# EAGLE design CANBed2040 (EAGLE 6.4)
DESCRIPTION: microOBD 200 OBD-II Module; HW_REV: 1.4; PCB_REV: C; PCB_SPEC1: Layer Count: 4; PCB_SPEC2: Size: 1.3" x 0.59"; PCB_SPEC3: Finish Thickness: 0.049" - 0.052"; PCB_SPEC4: Copper Weight: 1oz; TITLE: STM1120

## Sheet 1 of 2
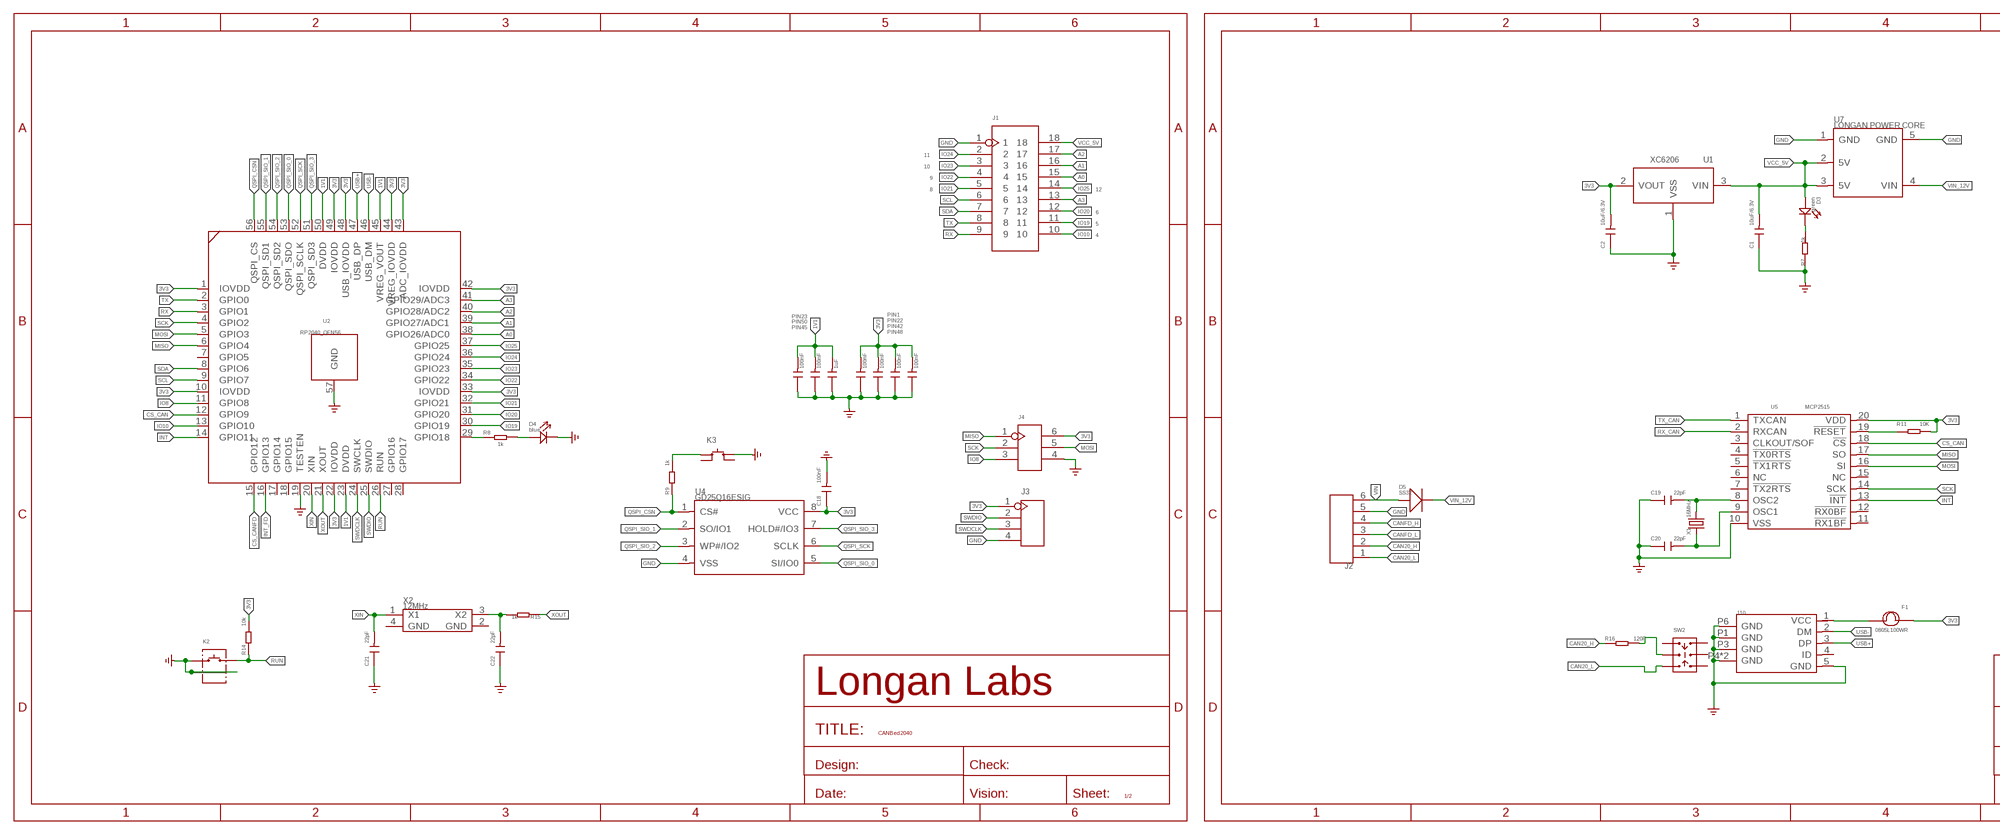
[diagram p0: schematic, sheet 1, part 1 of 2]
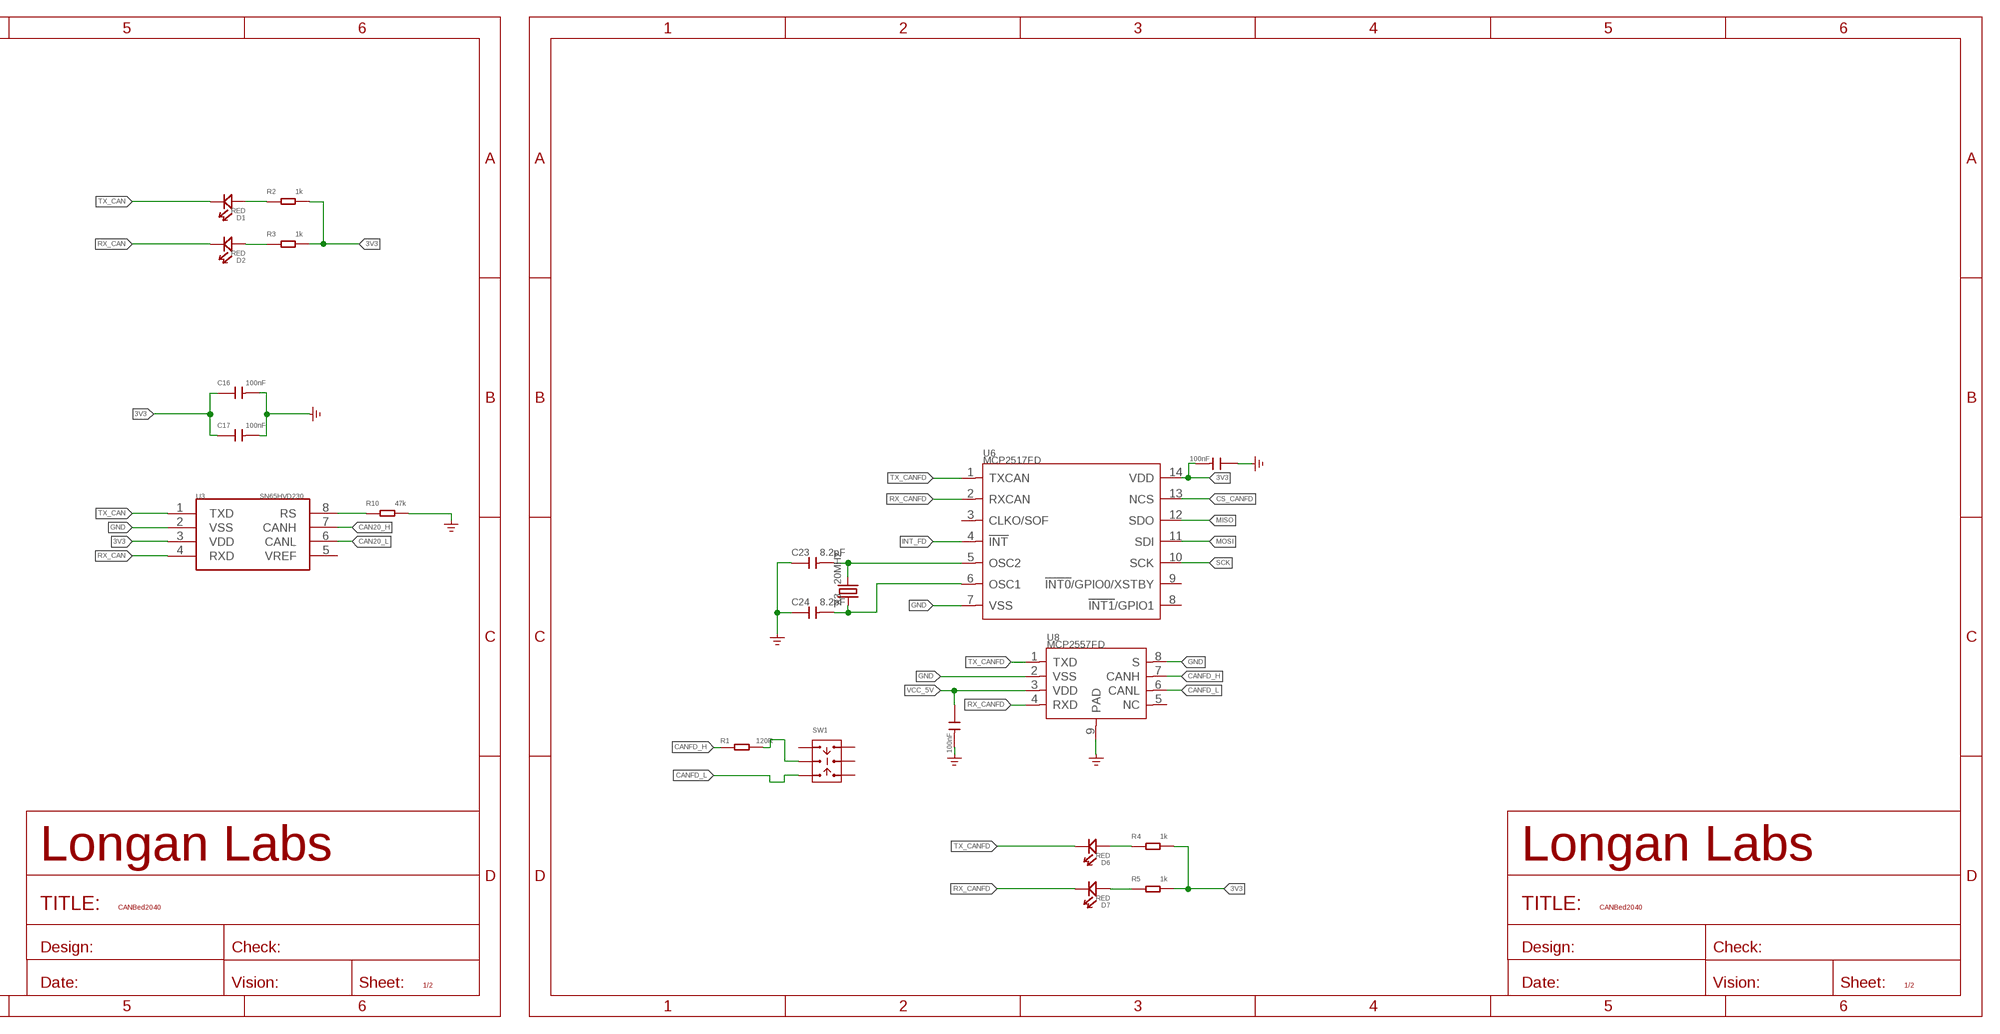
[diagram p1: schematic, sheet 1, part 2 of 2]

### Parts
C1  10uF/6.3V  CAP-0603  [C0603]
C2  10uF/6.3V  CAP-0603  [C0603]
C9  100nF  CAP-0603  [C0603]
C10  100nF  CAP-0603  [C0603]
C11  1uF  CAP-0603  [C0603]
C12  100nF  CAP-0603  [C0603]
C13  100nF  CAP-0603  [C0603]
C14  100nF  CAP-0603  [C0603]
C15  100nF  CAP-0603  [C0603]
C16  100nF  CAP-0603  [C0603]
C17  100nF  CAP-0603  [C0603]
C18  100nF  CAP-0603  [C0603]
C19  22pF  CAP-0603  [C0603]
C20  22pF  CAP-0603  [C0603]
C21  22pF  CAP-0603  [C0603]
C22  22pF  CAP-0603  [C0603]
C23  8.2pF  CAP-0603  [C0603]
C24  8.2pF  CAP-0603  [C0603]
C25  100nF  CAP-0603  [C0603]
C26  100nF  CAP-0603  [C0603]
D1  RED  LED'0603'  [LED-0603]
D2  RED  LED'0603'  [LED-0603]
D3  green  LED'0603'  [LED-0603]
D4  blue  LED'0603'  [LED-0603]
D5  SS32  DIODE'SMA'  [DO-214AC]
D6  RED  LED'0603'  [LED-0603]
D7  RED  LED'0603'  [LED-0603]
F1  0805L100WR  FUSE0805  [F0805]
J1  HEADER-2X9P-2.54  [H2X9-2.54]
J2  SCREW-TERMINAL-6P-3.5  [H6-3.5-21.7X7.0MM]
J3  HEADER-4P-SMD  [H4-SMD-2.54]
J4  HEADER-2X3P-2.54  [H2X3-2.54]
J10  MICRO-USB5+4P-320010050  [MICRO-USB5+5P-SMD-0.65-7.2X5.06MM]
K2  BUTTON-2+2P  [SW2+2P-7.7X2.75X3.95MM]
K3  BUTTON-4P-4.5X4.5X3.3MM  [SW4-4.5X4.5X3.3MM]
R1  120R  RES-0603  [R0603]
R2  1k  RES-0603  [R0603]
R3  1k  RES-0603  [R0603]
R4  1k  RES-0603  [R0603]
R5  1k  RES-0603  [R0603]
R7  1k  RES-0603  [R0603]
R8  1k  RES-0603  [R0603]
R9  1k  RES-0603  [R0603]
R10  47k  RES-0603  [R0603]
R11  10K  RES-0603  [R0603]
R14  10k  RES-0603  [R0603]
R15  1k  RES-0603  [R0603]
R16  120R  RES-0603  [R0603]
SW1  SWITCH-2CH-6P-311010004  [SW6-2.54-9.0X3.5X3.2+2.0MM]
SW2  SWITCH-2CH-6P-311010004  [SW6-2.54-9.0X3.5X3.2+2.0MM]
U1  XC6206  PMIC-XC6206PMR  [SOT-23]
U2  RP2040_QFN56  [RP2040_QFN56]
U3  SN65HVD230  MCP2551-SOIC8  [SOIC8-6.0]
U4  GD25Q16ESIG  FLASH-GD25Q16E  [SOP8-1.27-5.3X5.25X2MM]
U5  MCP2515  MCP2515'ST'  [TSSOP20-0.65-6.5X4.4MM]
U6  MCP2517FD  CONTROLLER-MCP2517FD  [SOIC14-1.27-8.6X3.9MM]
U7  LONGAN POWER CORE  MOUDLE-POWER_CORE  [MOUDLE5P-2.54-19X12MM]
U8  MCP2557FD  TRANSCEIVER-MCP2557FD  [TDFN8-0.5-2X3X0.75MM]
X1  16MHz  CRYSTAL-2P-3225  [X4-SMD-3.2X2.5X0.7MM]
X2  12MHz  CRYSTAL-4P-3225  [X4-SMD-3.2X2.5X0.7MM]
X3  20MHz  CRYSTAL-2P-3225  [X4-SMD-3.2X2.5X0.7MM]

### Nets
1V1: C9.2 C10.2 C11.2 U2.23(DVDD) U2.45(VREG_VOUT) U2.50(DVDD)
3V3: C2.2 C12.2 C13.2 C14.2 C15.2 C16.1 C17.1 C18.1 C25.2 F1.1 J3.1 J4.6 R2.2 R3.2 R4.2 R5.2 R11.2 R14.2 U1.2(VOUT) U2.1(IOVDD) U2.10(IOVDD) U2.22(IOVDD) U2.33(IOVDD) U2.42(IOVDD) U2.43(ADC_IOVDD) U2.44(VREG_IOVDD) U2.48(USB_IOVDD) U2.49(IOVDD) U3.3(VDD) U4.8(VCC) U5.20(VDD) U6.14(VDD)
A0: J1.15 U2.38(GPIO26/ADC0)
A1: J1.16 U2.39(GPIO27/ADC1)
A2: J1.17 U2.40(GPIO28/ADC2)
A3: J1.13 U2.41(GPIO29/ADC3)
CAN20_H: J2.2 R16.1 U3.7(CANH)
CAN20_L: J2.1 SW2.CH1B U3.6(CANL)
CANFD_H: J2.4 R1.1 U8.7(CANH)
CANFD_L: J2.3 SW1.CH1B U8.6(CANL)
CS_CAN: U2.12(GPIO9) U5.18(!CS)
CS_CANFD: U2.15(GPIO12) U6.13(NCS)
EXT_PWR: F1.2 J10.1(VCC)
GND: C1.1 C2.1 C9.1 C10.1 C11.1 C12.1 C13.1 C14.1 C15.1 C16.2 C17.2 C18.2 C19.1 C20.1 C21.1 C22.1 C23.1 C24.1 C25.1 C26.2 D4.- J1.1 J2.5 J3.4 J4.4 J10.5(GND) J10.P1(GND) J10.P3(GND) J10.P4(GND) J10.P5(GND) J10.P6(GND) K2.1 K2.S1 K2.S2 K3.3(B0) R7.1 R10.2 U1.1(VSS) U2.19(TESTEN) U2.57(GND) U3.2(VSS) U4.4(VSS) U5.10(VSS) U6.7(VSS) U7.1(GND) U7.5(GND) U8.2(VSS) U8.8(S) U8.9(PAD) ; supply symbol labelled GND_POWER
INT: U2.14(GPIO11) U5.13(!INT)
INT_FD: U2.16(GPIO13) U6.4(!INT)
IO8: J4.3 U2.11(GPIO8)
IO10: J1.10 U2.13(GPIO10)
IO19: J1.11 U2.30(GPIO19)
IO20: J1.12 U2.31(GPIO20)
IO21: J1.5 U2.32(GPIO21)
IO22: J1.4 U2.34(GPIO22)
IO23: J1.3 U2.35(GPIO23)
IO24: J1.2 U2.36(GPIO24)
IO25: J1.14 U2.37(GPIO25)
MISO: J4.1 U2.6(GPIO4) U5.17(SO) U6.12(SDO)
MOSI: J4.5 U2.5(GPIO3) U5.16(SI) U6.11(SDI)
N$1: D3.- R7.2
N$2: D1.+ R2.1
N$3: R8.1 U2.29(GPIO18)
N$4: R1.2 SW1.COM1
N$5: R16.2 SW2.COM1
N$6: D4.+ R8.2
N$7: K3.1(A0) R9.2
N$8: C22.2 R15.2 X2.3(X2)
N$9: D6.+ R4.1
N$10: D7.+ R5.1
N$11: C23.2 U6.5(OSC2) X3.3
N$12: C24.2 U6.6(OSC1) X3.1
N$15: D2.+ R3.1
N$16: C19.2 U5.8(OSC2) X1.3
N$17: C20.2 U5.9(OSC1) X1.1
N$20: R10.1 U3.8(RS)
QSPI_CSN: R9.1 U2.56(QSPI_CS) U4.1(CS#)
QSPI_SCK: U2.52(QSPI_SCLK) U4.6(SCLK)
QSPI_SIO_0: U2.53(QSPI_SDO) U4.5(SI/IO0)
QSPI_SIO_1: U2.55(QSPI_SD1) U4.2(SO/IO1)
QSPI_SIO_2: U2.54(QSPI_SD2) U4.3(WP#/IO2)
QSPI_SIO_3: U2.51(QSPI_SD3) U4.7(HOLD#/IO3)
RST_N: R11.1 U5.19(!RESET)
RUN: K2.2 R14.1 U2.26(RUN)
RX: J1.9 U2.3(GPIO1)
RX_CAN: D2.- U3.4(RXD) U5.2(RXCAN)
RX_CANFD: D7.- U6.2(RXCAN) U8.4(RXD)
SCK: J4.2 U2.4(GPIO2) U5.14(SCK) U6.10(SCK)
SCL: J1.6 U2.9(GPIO7)
SDA: J1.7 U2.8(GPIO6)
SWDCLK: J3.3 U2.24(SWCLK)
SWDIO: J3.2 U2.25(SWDIO)
TX: J1.8 U2.2(GPIO0)
TX_CAN: D1.- U3.1(TXD) U5.1(TXCAN)
TX_CANFD: D6.- U6.1(TXCAN) U8.1(TXD)
USB+: J10.3(DP) U2.47(USB_DP)
USB-: J10.2(DM) U2.46(USB_DM)
VCC_5V: C1.2 C26.1 D3.+ J1.18 U1.3(VIN) U7.2(5V) U7.3(5V) U8.3(VDD)
VIN: D5.1(+) J2.6
VIN_12V: D5.2(-) U7.4(VIN)
XIN: C21.2 U2.20(XIN) X2.1(X1)
XOUT: R15.1 U2.21(XOUT)
Unconnected: J10.4(ID) K3.2(A1) K3.4(B1) SW1.CH1A SW1.CH2A SW1.CH2B SW1.COM2 SW2.CH1A SW2.CH2A SW2.CH2B SW2.COM2 U2.7(GPIO5) U2.17(GPIO14) U2.18(GPIO15) U2.27(GPIO16) U2.28(GPIO17) U3.5(VREF) U5.3(CLKOUT/SOF) U5.4(!TX0RTS) U5.5(!TX1RTS) U5.6(NC) U5.7(!TX2RTS) U5.11(!RX1BF) U5.12(!RX0BF) U5.15(NC) U6.3(CLKO/SOF) U6.8(!INT1!/GPIO1) U6.9(!INT0!/GPIO0/XSTBY) U8.5(NC) X2.2(GND) X2.4(GND)

### Notes on the sheet
- 11
- 10
- 9
- 8 | 12
- 6
- 5
- 4
- PIN23
- PIN1
- PIN50
- PIN22
- PIN45
- PIN42
- PIN48

## Sheet 2 of 2

## Library data of the parts
C1 C2 C9-C26 = Discrete-new:CAP: Ceramic Capacitors
D1-D4 D6 D7 = Discrete-new:LED
D5 = Discrete-new:DIODE*
F1 = Discrete-small:FUSE
J1 = Connector-new:HEADER-2X9P
J2 = Connector-new:SCREW-TERMINAL-6P: 320110059
J3 = Connector-new:HEADER-4P
J4 = Connector-new:HEADER-2X3P
J10 = Connector-new:MICRO-USB5+4P: 320010137:MICRO USB B型DIP 沉板0.7无卷边 -ST-USB-01H2 320010000:MICRO USB 5F CCHT 6.45(0.8X0.9) -ST-USB-001G 320010050:USB-MC-001-05 320010025:MICRO USB 5S AB TYPE DIP7.2
K2 = Connector-new:BUTTON-2+2P
K3 = Switch:BUTTON-4P
R1-R5 R7-R11 R14-R16 = Discrete-new:RES
SW1 SW2 = Switch:SWITCH-2CH-6P
U1 = IC-new:PMIC-XC6206P: LOW ESR Cap.Compatible Positive Voltage Regulators
U2 = RP2040_QFN56:RP2040_QFN56
U3 = IC:MCP2551: High-Speed CAN Transceiver http://ww1.microchip.com/downloads/en/devicedoc/21667f.pdf
U4 = Longan-IC:FLASH-GD25Q16E
U5 = Heilight:MCP2515
U6 = untitled:CONTROLLER-MCP2517FD
U7 = Longan-moudle:MOUDLE-POWER_CORE
U8 = Longan-IC:TRANSCEIVER-MCP2557FD
X1 X3 = Discrete-new:CRYSTAL-2P
X2 = Discrete-new:CRYSTAL-4P

## Net classes
3 usbvcc: width 0.152 mm, drill 0.152 mm, clearance 0.152 mm

## Board
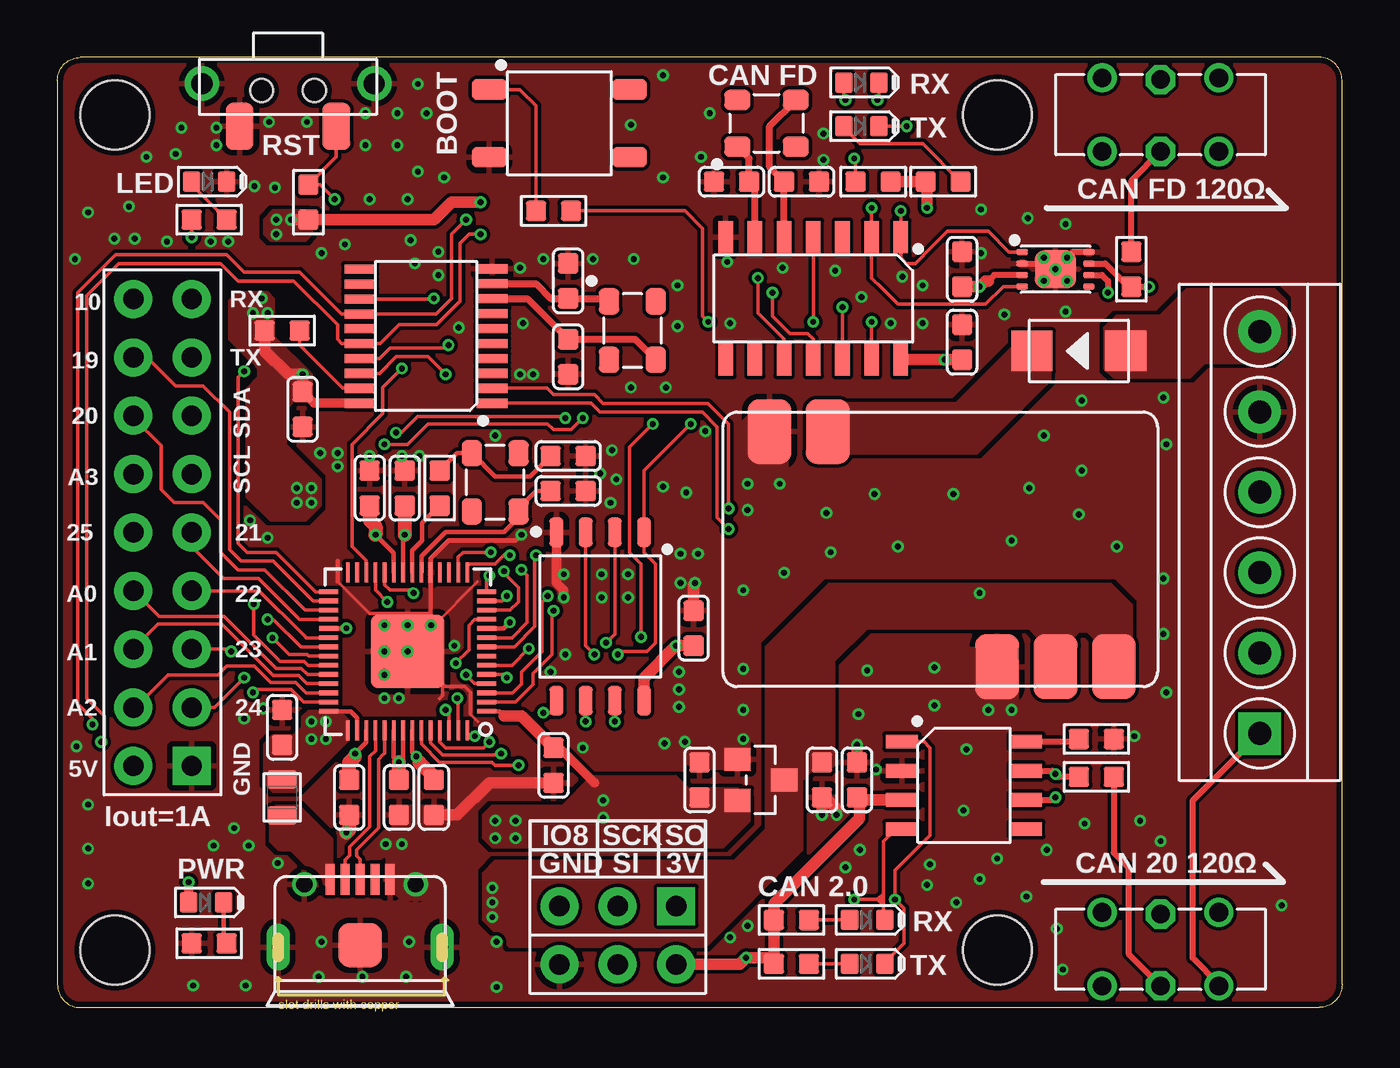
[diagram p2: board, top side]
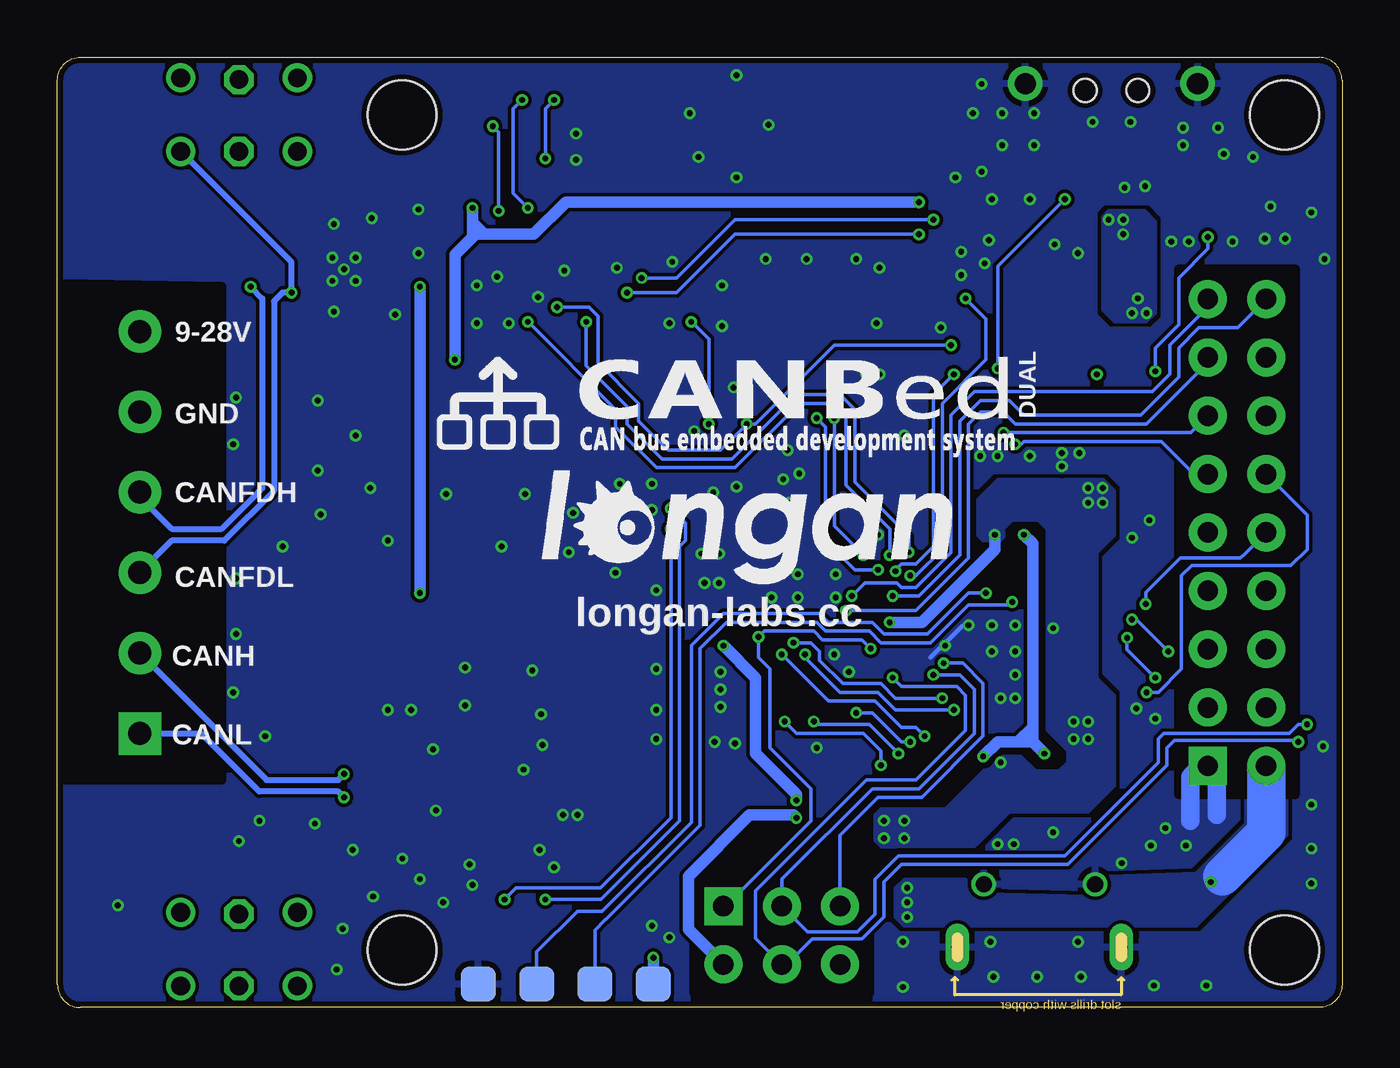
[diagram p3: board, bottom side, seen from below]

Size 55.91 x 41.35 mm. Coordinates in mm from the lower left corner, seen from the top.
Outline: 1,0 54.91,0 arc90 55.91,1 55.91,40.35 arc84 55.01,41.35 1,41.35 arc90 0,40.35 0,1 arc90 1,0
Copper layers (1*16): Top 0.035mm / dielectric 1.5mm / Bottom 0.035mm
Design rules "SeeedStudio_2layer_DRU_no_angle_20140221 *": minimum track width 1mil, minimum drill 10mil, track to track 6mil, track to pad 6mil, pad to pad 6mil, via to via 6mil, smd to smd 0mil, copper to edge 10mil, drill to drill 10mil, minimum pad ring 4mil, minimum via ring 4mil, stop-mask expansion 2mil, vias tented up to drill 25mil, thermal gap 10mil
Holes 3 mm at 2.5,38.85 2.5,2.5 40.91,38.85 40.91,2.5
bRestrict: area 2,9.3 to 7.1,32.1; area 48.8,9.9 to 55.9,31.5; area 20.6,0.6 to 28.2,5.7

### Footprints (pad centres in the part's own frame; a part is rotated, then mirrored left to right if it is on the bottom)
C0603 = smd 0.889 x 0.889: 1 -0.762,0; 2 0.762,0
LED-0603 = smd 0.762 x 0.889: + 0.762,0; - -0.762,0
DO-214AC = smd 1.8 x 1.77: 1 -2.042,0; 2 2.042,0
F0805 = smd 0.819 x 1.27: 1 -0.79,0; 2 0.79,0
H2X9-2.54 = drill 0.889 pad 1.651 square: 1 -1.27,10.16 | drill 0.889 pad 1.651: 2 -1.27,7.62; 3 -1.27,5.08; 4 -1.27,2.54; 5 -1.27,0; 6 -1.27,-2.54; 7 -1.27,-5.08; 8 -1.27,-7.62; 9 -1.27,-10.16; 10 1.27,-10.16; 11 1.27,-7.62; 12 1.27,-5.08; 13 1.27,-2.54; 14 1.27,0; 15 1.27,2.54; 16 1.27,5.08; 17 1.27,7.62; 18 1.27,10.16
H6-3.5-21.7X7.0MM = drill 1 pad 1.85 square: 1 -8.75,0 | drill 1 pad 1.85: 2 -5.25,0; 3 -1.75,0; 4 1.75,0; 5 5.25,0; 6 8.75,0
H4-SMD-2.54 = smd 1.524 x 1.524: 1 0,5.08; 2 0,2.54; 3 0,0; 4 0,-2.54
H2X3-2.54 = drill 0.889 pad 1.651 square: 1 -1.27,2.54 | drill 0.889 pad 1.651: 2 -1.27,0; 3 -1.27,-2.54; 4 1.27,-2.54; 5 1.27,0; 6 1.27,2.54
MICRO-USB5+5P-SMD-0.65-7.2X5.06MM = smd 0.4 x 1.35: 1 -1.3,2.875; 2 -0.65,2.875; 3 0,2.875; 4 0.65,2.875; 5 1.3,2.875 | smd 1.9 x 1.9: P1 0,0 | drill 0.508 pad 1.016 long: P3 -3.575,-0.08; P4 3.575,-0.08 | drill 0.7: P5 -2.425,2.65; P6 2.425,2.65
SW2+2P-7.7X2.75X3.95MM = smd 1.2 x 2.032: 1 -2.1,-0.254; 2 2.1,-0.254 | drill 0.924 pad 1.5: S1 -3.75,1.6; S2 3.75,1.6 | hole 1: -1.15,1.3; 1.15,1.3
SW4-4.5X4.5X3.3MM = smd 1.5 x 0.9: 1 -3.05,1.475; 2 3.05,1.475; 3 -3.05,-1.475; 4 3.05,-1.475
R0603 = smd 0.889 x 0.889: 1 -0.762,0; 2 0.762,0
SW6-2.54-9.0X3.5X3.2+2.0MM = drill 0.813 pad 1.27: CH1A -2.54,-1.6; CH1B 2.54,-1.6; CH2A -2.54,1.6; CH2B 2.54,1.6 | drill 0.813 pad 1.27 octagon: COM1 0,-1.6; COM2 0,1.524
SOT-23 = smd 1.016 x 1.143: 1 -0.889,-1.016; 2 0.889,-1.016; 3 0,1.016
RP2040_QFN56 = smd 0.875 x 0.2: 1 -3.438,2.6; 2 -3.438,2.2; 3 -3.438,1.8; 4 -3.438,1.4; 5 -3.438,1; 6 -3.438,0.6; 7 -3.438,0.2; 8 -3.438,-0.2; 9 -3.438,-0.6; 10 -3.438,-1; 11 -3.438,-1.4; 12 -3.438,-1.8; 13 -3.438,-2.2; 14 -3.438,-2.6; 29 3.438,-2.6; 30 3.438,-2.2; 31 3.438,-1.8; 32 3.438,-1.4; 33 3.438,-1; 34 3.438,-0.6; 35 3.438,-0.2; 36 3.438,0.2; 37 3.438,0.6; 38 3.438,1; 39 3.438,1.4; 40 3.438,1.8; 41 3.438,2.2; 42 3.438,2.6 | smd 0.2 x 0.875: 15 -2.6,-3.438; 16 -2.2,-3.438; 17 -1.8,-3.438; 18 -1.4,-3.438; 19 -1,-3.438; 20 -0.6,-3.438; 21 -0.2,-3.438; 22 0.2,-3.438; 23 0.6,-3.438; 24 1,-3.438; 25 1.4,-3.438; 26 1.8,-3.438; 27 2.2,-3.438; 28 2.6,-3.438; 43 2.6,3.438; 44 2.2,3.438; 45 1.8,3.438; 46 1.4,3.438; 47 1,3.438; 48 0.6,3.438; 49 0.2,3.438; 50 -0.2,3.438; 51 -0.6,3.438; 52 -1,3.438; 53 -1.4,3.438; 54 -1.8,3.438; 55 -2.2,3.438; 56 -2.6,3.438 | smd 3.2 x 3.2: 57 0,0
SOIC8-6.0 = smd 0.6 x 1.4: 1 -1.905,-2.7; 2 -0.635,-2.7; 3 0.635,-2.7; 4 1.905,-2.7; 5 1.905,2.7; 6 0.635,2.7; 7 -0.635,2.7; 8 -1.905,2.7
SOP8-1.27-5.3X5.25X2MM = smd 0.6 x 1.27: 1 -1.905,-3.665; 2 -0.635,-3.665; 3 0.635,-3.665; 4 1.905,-3.665; 5 1.905,3.665; 6 0.635,3.665; 7 -0.635,3.665; 8 -1.905,3.665
TSSOP20-0.65-6.5X4.4MM = smd 0.4 x 1.35: 1 -2.925,-2.875; 2 -2.275,-2.875; 3 -1.625,-2.875; 4 -0.975,-2.875; 5 -0.325,-2.875; 6 0.325,-2.875; 7 0.975,-2.875; 8 1.625,-2.875; 9 2.275,-2.875; 10 2.925,-2.875; 11 2.91,2.875; 12 2.26,2.875; 13 1.61,2.875; 14 0.96,2.875; 15 0.325,2.875; 16 -0.325,2.875; 17 -0.975,2.875; 18 -1.625,2.875; 19 -2.275,2.875; 20 -2.925,2.875
SOIC14-1.27-8.6X3.9MM = smd 0.635 x 1.397: 1 -3.81,-2.667; 2 -2.54,-2.667; 3 -1.27,-2.667; 4 0,-2.667; 5 1.27,-2.667; 6 2.54,-2.667; 7 3.81,-2.667; 8 3.81,2.667; 9 2.54,2.667; 10 1.27,2.667; 11 0,2.667; 12 -1.27,2.667; 13 -2.54,2.667; 14 -3.81,2.667
MOUDLE5P-2.54-19X12MM = smd 2.8 x 1.9: 1 -5.234,-2.159; 2 -5.234,-4.699; 3 -5.234,-7.239; 4 5,5.207; 5 5,7.747
TDFN8-0.5-2X3X0.75MM = smd 0.25 x 0.5: 1 -0.75,-1.45; 2 -0.25,-1.45; 3 0.25,-1.45; 4 0.75,-1.45; 5 0.75,1.45; 6 0.25,1.45; 7 -0.25,1.45; 8 -0.75,1.45 | smd 1.65 x 1.8: 9 0,0
X4-SMD-3.2X2.5X0.7MM = smd 1.143 x 0.889: 1 -1.27,-1.016; 2 1.27,-1.016; 3 1.27,1.016; 4 -1.27,1.016

### Placement (x,y rotation side)
C1  33.27,9.91 90 top
C2  27.94,9.91 270 top
C9  13.59,22.61 270 top
C10  16.38,9.14 90 top
C11  12.7,9.14 90 top
C12  21.59,10.54 90 top
C13  15.11,22.61 270 top
C14  9.78,12.19 270 top
C15  14.86,9.14 90 top
C16  10.67,26.04 270 top
C17  34.8,9.91 90 top
C18  27.69,16.51 90 top
C19  22.22,28.32 90 top
C20  22.22,31.62 270 top
C21  22.22,22.48 180 top
C22  22.22,24 180 top
C23  32.38,35.94 180 top
C24  29.34,35.94 0 top
C25  39.37,28.96 270 top
C26  39.37,32.13 90 top
D1  35.24,1.91 180 top
D2  35.24,3.81 180 top
D3  6.48,4.57 180 top
D4  6.6,35.94 180 top
D5  44.45,28.57 180 top
D6  34.99,38.35 180 top
D7  34.99,40.26 180 top
F1  9.78,9.14 270 top
J1  4.57,20.68 180 top
J2  52.32,20.68 90 top
J3  35.05,1.02 270 bottom
J4  24.38,3.14 270 top
J10  13.17,2.71 0 top
K2  10.03,38.61 0 top
K3  21.84,38.48 0 top
R1  46.74,32.13 90 top
R2  31.94,1.91 180 top
R3  31.94,3.81 180 top
R4  38.54,35.94 180 top
R5  35.5,35.94 0 top
R7  6.6,2.79 0 top
R8  6.6,34.29 0 top
R9  21.59,34.67 180 top
R10  45.21,11.68 0 top
R11  9.78,29.46 180 top
R14  10.92,35.05 270 top
R15  16.64,22.61 90 top
R16  45.21,10.03 0 top
SW1  48.01,38.86 0 top
SW2  48.01,2.54 0 top
U1  30.61,9.91 270 top
U2  15.24,15.49 180 top
U3  39.45,9.67 270 top
U4  23.62,17.02 180 top
U5  16.05,29.22 90 top
U6  32.89,30.86 180 top
U7  38.73,20.07 90 top
U8  43.43,32.13 270 top
U$12  [LONGAN-SILK-SMALL]  36.44,16.97 0 bottom
X1  25.02,29.46 270 top
X2  19.05,22.86 90 top
X3  30.86,38.48 0 top

### Tracks (layer width: path | path; a pad name or v marks a point on that pad's centre or on a via)
1V1  (via drill 0.25 pad 0.51)
  Top 0.203: U2.23 14.64,19.78 v13.84,20.57 | U2.45 13.44,11.53 v12.95,11.05 12.95,10.92 | U2.50 15.44,11.1 v15.62,10.92 15.62,10.8 15.75,10.67
  Top 0.61: C9.2 13.59,21.21 13.84,20.95 v13.84,20.57 | C10.2 16.38,10.03 15.75,10.67 | C11.2 12.7,10.67 12.95,10.92
  Bottom 0.508: v12.95,11.05 13.46,11.56 | 13.46,11.56 14.1,11.56 | 14.1,11.56 14.99,11.56 v15.62,10.92 | 13.46,11.56 13.46,12.19 | 13.46,12.19 13.46,20.19 v13.84,20.57 | 13.46,12.19 14.1,11.56
3V3  (via drill 0.25 pad 0.51)
  Top 0.203: U2.33 12.56,16.49 v12.57,16.51 | U2.22 15.04,20.5 v15.11,20.57 | U2.44 13.04,12.61 12.76,12.89 U2.42 | U2.48 14.64,10.89 v14.86,10.67 15.04,10.85 U2.49 | U2.1 19.24,12.89 19.43,12.7 | U2.10 19.41,16.49 v19.68,16.76
  Top 0.406: C16.1 11.16,26.3 U5.20 | 23.37,9.78 21.84,11.3 C12.2
  Top 0.508: C16.1 v10.67,27.56 10.03,27.56 9.02,28.57 R11.2 | v10.16,34.29 R14.2 16.38,34.29 17.14,35.05 v18.41,35.05 | 19.43,12.7 20.19,12.7 C12.2 | C18.1 v26.92,15.75 25.53,14.35 U4.8 | 34.91,9.03 C17.1 | J4.6 29.68,1.87 v29.97,2.16 30.92,2.16 R2.2 R3.2 31.18,4.51 34.91,8.24 34.91,9.03 | U3.3 34.91,9.03 | v37.85,34.8 37.85,35.88 R4.2 R5.2 | C25.2 v38.61,28.19 U6.14
  Top 0.61: C13.2 v15.11,20.57 | C15.2 v14.86,10.67
  Bottom 0.508: J4.6 28.45,3.4 28.45,5.72 25.78,8.38 23.88,8.38 v23.75,8.26 | v26.92,15.75 25.53,14.35 25.53,11.05 23.75,9.27 v23.75,9.02 | v15.11,20.57 15.11,19.94 18.29,16.76 v19.68,16.76 | J3.1 v29.97,2.16 | v18.41,35.05 33.78,35.05 35.18,33.66 37.21,33.66 37.34,33.66 | 37.34,33.66 37.72,33.66 37.78,33.59 | v38.61,28.19 38.61,32.77 37.78,33.59 | v37.85,34.8 37.85,34.16 | 37.85,34.16 37.85,33.66 37.78,33.59 | 37.34,33.66 37.85,34.16
  other vias: 11.05,12.45 11.05,11.68 11.68,11.68 11.68,12.45 19.05,8.13 19.94,8.13 19.94,7.37 19.05,7.37 11.05,22.61 10.41,22.61 10.41,21.97 11.05,21.97 9.14,30.23 8.51,30.23 8.89,30.86 9.52,34.29 9.52,33.66
  pour Top (isolate 0.254, no thermals): 9.4,9.4 9.39,9.4 9.02,9.79 9.02,11.45 9.38,11.81 10.29,11.81 10.67,12.19 10.67,12.64 10.92,12.89 12.26,12.89 12.64,12.51 12.64,11.62 10.41,9.4 10.14,9.4
  pour Bottom (isolate 0.254, no thermals): 14.35,21.21 13.23,21.21 12.83,20.81 12.83,12.06 11.94,11.18 11.94,10.67 12.32,10.29 13.33,10.29 13.97,10.92 14.99,10.92 17.27,8.64 20.07,8.64 20.32,8.38 20.32,7.27 20.04,6.98 16.03,6.98 15.87,7.11 14.48,8.51 11.05,8.51 9.91,9.65 9.91,13.59 10.67,14.35 10.67,19.81 9.91,20.57 9.91,22.48 10.41,22.99 14.99,22.99 15.87,22.1 15.87,20.57 15.62,20.32 14.86,20.32 14.73,20.45 14.73,20.83
  pour Top (isolate 0.254, no thermals): 26.92,10.03 23.24,10.03 23.24,10.03 21.97,8.76 18.92,8.76 18.54,8.38 18.54,7.39 18.94,6.98 28.96,6.98 30.1,8.13 30.1,9.02 29.59,9.52 27.43,9.52
  pour Top (isolate 0.254, no thermals): 11.43,21.84 11.43,22.99 9.91,24.51 9.91,26.04 10.29,26.42 10.79,26.42 11.05,26.67 11.05,27.56 9.4,29.21 9.4,30.86 9.14,31.11 7.87,31.11 7.49,30.73 7.49,29.08 8.76,27.81 8.76,27.43 8.25,26.92 8.25,22.23 9.27,21.21 10.79,21.21
  pour Bottom (isolate 0.254, no thermals): 10.16,34.67 8.59,34.67 8.13,34.21 8.13,30.23 8.51,29.84 9.91,29.84 10.41,30.35 10.41,34.42
  pour Top (isolate 0.254, no thermals): 10.67,34.67 9.4,34.67 9.02,34.29 9.02,33.66 9.27,33.4 10.79,33.4 11.05,33.66 11.05,34.42 10.79,34.67
A0
  Top 0.152: J1.15 4.42,17.02 7.26,17.02 9.52,14.76 10.62,14.76 10.88,14.49 U2.38
A1
  Top 0.152: J1.16 3.3,15.62 4.38,16.7 7.15,16.7 9.4,14.45 10.49,14.45 10.85,14.09 U2.39
A2
  Top 0.152: J1.17 3.4,13.05 4.83,14.48 6.98,14.48 7.37,14.86 8.56,14.86 9.27,14.15 10.36,14.15 10.82,13.69 U2.40
A3  (via drill 0.25 pad 0.51)
  Top 0.152: U2.41 10.71,13.29 10.16,13.84 8.64,13.84 v8.51,13.72
  Bottom 0.152: J1.13 1.52,21.44 1.52,19.94 2.22,19.24 6.54,19.24 6.98,18.8 6.98,14.73 8,13.72 v8.51,13.72
CAN20_H  (via drill 0.25 pad 0.51)
  Top 0.254: U3.7 43.29,10.3 v43.43,10.16 43.56,10.03 R16.1
  Bottom 0.254: J2.2 46.8,9.91 43.69,9.91 v43.43,10.16
CAN20_L  (via drill 0.25 pad 0.51)
  Top 0.254: U3.6 43.32,9.03 v43.43,9.14 | SW2.CH1B 50.55,1.02 49.4,2.16 49.4,9 J2.1
  Bottom 0.254: v43.43,9.14 43.69,9.4 47.12,9.4 49.64,11.92 J2.1
CANFD_H  (via drill 0.25 pad 0.51)
  Top 0.254: U8.7 45.6,32.38 46.61,31.37 R1.1 v47.5,31.37
  Bottom 0.254: v47.5,31.37 46.99,30.86 46.99,22.61 47.12,22.48 47.18,22.42 48.77,20.83 50.93,20.83 52.32,22.23 J2.4
CANFD_L  (via drill 0.25 pad 0.51)
  Top 0.254: U8.6 45.46,31.88 45.72,31.62 v45.72,31.11
  Bottom 0.254: SW1.CH1B 45.72,32.44 v45.72,31.11 46.1,31.11 46.48,30.73 46.48,22.48 48.64,20.32 50.93,20.32 J2.3
CS_CAN  (via drill 0.25 pad 0.51)
  Top 0.152: U2.12 19.71,17.29 20.07,17.65 20.07,18.29 19.62,18.73 19.56,18.8 19.43,18.92 v19.43,18.99 | U5.18 14.01,27.6 14.73,28.32 16.13,28.32 v16.89,27.56
  Bottom 0.152: v16.89,27.56 17.78,26.67 17.78,20.07 18.54,19.3 19.18,19.3 19.43,19.05 v19.43,18.99
CS_CANFD  (via drill 0.25 pad 0.51)
  Top 0.152: v19.68,19.68 19.43,19.68 19.05,19.3 17.91,19.3 17.84,19.24 U2.15 | U6.13 v35.43,29.84
  Bottom 0.152: v19.68,19.68 19.68,20.83 21.59,22.73 21.59,25.91 21.97,26.29 23.62,26.29 26.42,23.5 29.84,23.5 31.62,25.27 31.62,26.04 v35.43,29.84
EXT_PWR
  pour Top (isolate 0.254, no thermals): 11.81,5.21 10.16,6.86 9.65,6.86 9.27,7.24 9.27,8.51 9.52,8.76 10.52,8.76 11.94,7.34 11.94,5.33
GND  (via drill 0.25 pad 0.51)
  Top 0.127: 13.58,17.15 12.19,18.54 | 18.28,18.54 16.38,16.64 v16.26,16.64 | 17.97,12.76 18.29,12.45
  Top 0.152: 16.24,17.15 13.58,17.15 | 15.24,15.37 15.49,15.37 16.76,14.1 | 16.76,14.1 16.89,13.97 17.72,13.97 17.97,13.72 17.97,12.76 | 16.76,14.1 16.76,13.59 16.64,13.46
  Top 0.203: U2.57 15.24,15.37 16.24,16.37 16.24,17.15 U2.19 16.24,19.54 17.02,20.32 19.94,20.32 v20.19,20.57 | 12.19,18.54 12.19,19.43 | 21.72,20.32 21.78,20.26
  Top 0.254: U8.2 42.67,32.38 v42.93,32.64 | U8.8 44.18,32.88 v43.94,32.64
  Top 0.406: 21.78,20.26 21.72,20.19 U4.4 21.72,18.48 22.03,18.16 v22.03,17.84
  Top 0.508: C18.2 27.69,18.41 v27.75,18.48 | C12.1 18.8,9.78 17.4,8.38 C10.1 | v33.27,8.38 C1.1 33.4,9.14 33.91,8.64 v33.91,8.38 | C17.2 v34.8,11.43
  Top 0.61: C11.1 12.7,7.75 v12.57,7.62
  Bottom 0.152: v16.26,16.64 16.51,16.64
  Bottom 0.203: 16.51,16.64 17.91,15.24
  Bottom 0.813: 6.6,8.13 6.6,10.03 6.12,10.52 J1.1 5.84,10.16 5.71,10.16 5.46,9.91 5.46,8.38
  other vias: 20.13,32.19 20.26,29.78 14.8,38.93 5.4,38.29 5.14,37.15 3.87,37.02 1.33,34.61 1.33,6.92 1.33,5.4 7.68,7.81 11.49,2.86 15.3,2.86 19.11,2.86 19.11,0.89 15.56,32.38 26.48,26.99 25.08,32.58 21.15,32.58 24.96,26.99 5.91,0.95 8.19,0.95 22.86,11.3 26.42,11.49 29.27,3.05 30.04,3.56 16.57,31.88 8.95,13.02 53.28,4.45 43.5,3.43 43.75,1.65 27.11,18.48 27.11,19.75 27.88,19.75 27.37,22.42 30.04,21.65 30.04,22.8 20.13,27.56 20.7,27.56 23.3,32.58 27.05,14.6 27.05,13.84 27.05,13.08 8.13,12.57 12.19,24.13 12.19,23.56 13.59,24 14.99,24 8.57,35.75 12.51,33.21 11.49,32.83 15.24,15.49 15.24,16.64 14.22,16.64 14.22,15.49 14.22,14.48 14.22,13.46 14.86,13.46 14.99,7.11 22.1,15.37 15.37,33.4 13.59,35.18 15.24,35.18 9.46,35.69 17.46,29.59 16.57,32.89 6.79,7.05 9.59,6.29 8.32,7.05 1.33,8.83 14.29,7.11 17.27,15.75 23.69,17.84 24.83,17.84 14.8,37.53 13.4,37.53 13.4,38.93 6.92,38.29 6.92,37.53 9.21,38.54 10.86,38.54 11.43,24.13 15.75,24 8.38,21.21 9.14,20.45 6.67,33.34 7.43,33.34 3.11,34.86 2.48,33.46 3.37,33.46 4.76,33.34 0.76,32.58 0.83,11.37 23.62,23.24 24.13,24.26 24.32,22.99 24.07,21.97 19.05,24.89 22.03,18.86 23.69,18.86 24.83,18.86 21.46,14.6 16.07,38.93 16.83,36.13 24.96,38.42 26.35,40.58 15.68,40.2 28.38,38.93 33.34,38.04 33.34,36.89 28,37.02 26.35,36.13 15.68,36.39 29.15,32.45 31.56,32.19 33.85,32.07 34.99,30.92 36.77,31.81 37.66,31.43 29.27,29.78 26.99,31.43 26.99,29.65 41.21,30.16 43.88,30.29 40.2,32.83 43.43,32.13 42.93,31.62 43.94,31.62 27.3,11.56 29.84,11.68 29.84,12.95 29.84,14.73 29.84,18.16 31.62,18.92 36.58,20.07 35.56,22.35 33.66,19.81 38.99,22.35 41.53,20.32 42.29,22.61 44.45,21.46 46.1,20.07 44.58,23.37 44.58,26.42 42.93,24.89 48.13,26.54 48.26,24.51 48.13,18.67 48.13,16.26 48.26,13.72 46.86,11.81 41.53,12.95 40.51,12.95 34.92,6.86 34.29,6.1 37.97,6.22 37.85,5.33 40.13,5.59 40.89,6.48 43.05,6.86 44.7,8 47.12,8.13 48.01,7.24 42.16,4.83 39.12,4.57 35.62,10.35 34.86,12.76 35.24,14.67 38.16,14.8 38.16,13.14 31.43,22.8 33.46,21.53 36.26,29.78 37.66,29.78 39.56,11.24 39.43,8.57 43.88,34.1 42.23,34.35 40.2,34.73 11.37,1.33 13.27,1.33 15.18,1.33 26.35,22.67 28.19,25.08
  pour Top (isolate 0.254, no thermals): 26.67,13.84 26.67,13.01 25.86,12.19 22.61,12.19 22.61,10.92 27.18,10.92 27.69,10.41 29.72,10.41 30.1,10.8 30.1,14.48 29.59,14.99 27.81,14.99
  pour Top (isolate 0.127, rank 6): -0.64,41.91 56.51,41.91 56.51,-0.63 -0.64,-0.63
  pour Bottom (isolate 0.127, rank 6): -0.64,41.91 56.51,41.91 56.51,-0.63 -0.64,-0.63
  pour Top (isolate 0.254, no thermals): 16.38,8.76 14.86,8.76 14.6,8.51 14.6,7.62 14.35,7.37 14.35,5.33 14.99,4.7 16.64,4.7 17.14,5.21 17.14,8.38 16.76,8.76
  pour Top (isolate 0.254, no thermals): 31.11,26.04 30.35,26.04 29.72,25.4 29.72,21.72 29.97,21.46 31.37,21.46 31.75,21.84 31.75,25.53 31.24,26.04
  pour Top (isolate 0.254, no thermals): 40.51,15.62 37.85,15.62 37.34,15.11 37.34,13.08 37.85,12.57 41.4,12.57 41.78,12.95 41.78,15.11 41.27,15.62
INT  (via drill 0.25 pad 0.51)
  Top 0.152: U5.13 16.36,30.83 v16.38,30.86 | U2.14 18.68,18.68 v18.8,18.8
  Bottom 0.152: v18.8,18.8 18.54,18.8 17.4,19.94 17.4,26.29 15.49,28.19 15.49,29.97 v16.38,30.86
INT_FD  (via drill 0.25 pad 0.51)
  Top 0.152: U2.16 17.44,19.6 17.65,19.81 v18.86,19.81 | U6.4 v32.89,29.84
  Bottom 0.152: v18.86,19.81 18.86,20.51 21.21,22.86 21.21,26.04 21.84,26.67 23.75,26.67 26.54,23.88 29.59,23.88 31.11,25.4 31.11,26.16 32.89,27.94 v32.89,29.84
IO8  (via drill 0.25 pad 0.51)
  Top 0.152: U2.11 18.16,16.89 17.91,16.64 17.91,15.56 v17.34,14.99
  Bottom 0.152: J4.3 21.84,7.49 20.19,9.14 18.29,9.14 15.62,11.81 15.62,14.1 16.51,14.99 v17.34,14.99
IO10  (via drill 0.25 pad 0.51)
  Top 0.152: U2.13 19.34,17.69 v19.56,17.91
  Bottom 0.152: J1.10 4.55,29.59 6.22,29.59 7.11,28.7 7.11,27.43 8.76,25.78 13.84,25.78 14.48,26.42 15.75,26.42 16.64,25.53 16.64,19.68 18.41,17.91 v19.56,17.91
IO19
  Top 0.152: U2.30 11.13,17.69 9.4,19.43 8,19.43 7.49,19.94 7.49,25.91 6.35,27.05 5.14,27.05 3.9,28.3 J1.11
IO20
  Top 0.152: U2.31 10.77,17.29 9.02,19.05 7.87,19.05 7.11,19.81 7.11,21.21 6.35,21.97 5.08,21.97 4.51,22.54 4.51,24.45 3.3,25.65 J1.12
IO21
  Top 0.152: U2.32 10.54,16.89 8.76,18.67 7.24,18.67 6.1,19.81 5.97,19.94 5.84,20.07 J1.5
IO22
  Top 0.152: J1.4 8.79,18.14 10.67,16.26 10.79,16.13 10.83,16.09 U2.34
IO23  (via drill 0.25 pad 0.51)
  Top 0.152: U2.35 10.59,15.69 9.4,16.89 v9.14,16.89 | J1.3 7.45,15.59 v7.56,15.49
  Bottom 0.152: v9.14,16.89 8.95,16.89 v7.56,15.49
IO24  (via drill 0.25 pad 0.51)
  Top 0.152: U2.36 10.94,15.29 10.87,15.37 10.08,15.37 v9.36,16.09 | J1.2 6.83,13.05 v8.13,14.35
  Bottom 0.152: v9.36,16.09 9.36,15.58 v8.13,14.35
IO25  (via drill 0.25 pad 0.51)
  Top 0.152: U2.37 10.91,14.89 10.74,15.06 9.7,15.06 8.54,16.22 v8.54,17.56
  Bottom 0.152: J1.14 4.3,19.67 4.36,19.62 4.42,19.56 7.05,19.56 8.54,18.06 v8.54,17.56
MISO  (via drill 0.25 pad 0.51)
  Top 0.152: U2.6 19.78,14.89 v20.51,15.62 | U5.17 14.02,28.25 14.48,28.7 16.89,28.7 v17.02,28.83 | v25.4,16.13 25.4,19.3 24.89,19.81 24.89,24.38 v25.91,25.4 | U6.12 v34.16,30.48
  Bottom 0.152: J4.1 26.83,4.41 23.11,8.13 23.11,9.52 24.89,11.3 24.89,14.73 25.4,15.24 v25.4,16.13 25.15,16.38 22.99,16.38 22.61,16 20.89,16 v20.51,15.62 | v17.02,28.83 22.1,28.83 25.53,25.4 v25.91,25.4 27.05,24.26 29.34,24.26 30.61,25.53 30.61,26.29 32.38,28.07 32.38,30.1 32.77,30.48 v34.16,30.48
MOSI  (via drill 0.25 pad 0.51)
  Top 0.152: U2.5 19.41,14.49 v19.56,14.35 | v1.9,11.56 2.03,11.68 2.03,12.7 1.27,13.46 1.27,30.99 2.67,32.38 7.11,32.38 7.87,31.62 10.29,31.62 12.19,29.72 12.19,29.08 12.37,28.9 U5.16 14.04,28.9 14.86,29.72 16.51,29.72 17.53,30.73 17.53,33.27 17.91,33.66 v18.41,33.66 | U6.11 32.89,29.08 32.64,29.34 31.88,29.34 31.11,30.1 v31.11,31.11
  Bottom 0.152: v19.56,14.35 19.18,13.97 16.76,13.97 16.38,13.59 16.38,12.06 18.54,9.91 20.7,9.91 25.53,5.08 25.53,3.02 J4.5 24.16,1.87 23.05,2.98 20.89,2.98 19.94,3.94 19.94,5.46 19.18,6.22 11.94,6.22 7.62,10.54 7.62,11.3 7.3,11.62 1.97,11.62 v1.9,11.56 | v18.41,33.66 26.42,33.66 28.96,31.11 v31.11,31.11
N$1
  Top 0.203: D3.- 7.24,2.92 R7.2
N$2
  Top 0.152: D1.+ R2.1
N$3  (via drill 0.25 pad 0.51)
  Top 0.152: U2.29 11.24,18.09 9.52,19.81 8.25,19.81 7.87,20.19 7.87,27.43 v8.13,27.69 | R8.1 v5.84,33.53
  Bottom 0.152: v5.84,33.53 5.84,33.02 7.11,31.75 7.11,29.72 8.13,28.7 v8.13,27.69
N$4
  Top 0.254: R1.2 46.74,35.99 SW1.COM1
N$5
  Top 0.254: R16.2 45.97,6.73 46.61,6.1 46.61,2.34 SW2.COM1
N$6
  Top 0.152: D4.+ 5.84,35.81 R8.2
N$7
  Top 0.152: R9.2 20.83,39.24 20.11,39.96 K3.1
N$8
  Top 0.203: R15.2 17.4,24.13 X2.3 19.05,23.11 20.57,23.11 C22.2
N$9
  Top 0.152: D6.+ 34.23,38.29 34.92,37.59 37.66,37.59 R4.1
N$10  (via drill 0.25 pad 0.51)
  Top 0.152: R5.1 34.73,36.89 v34.67,36.96 | D7.+ 34.23,39.56 v34.29,39.5
  Bottom 0.152: v34.67,36.96 34.67,39.12 v34.29,39.5
N$11
  Top 0.305: U6.5 C23.2 30.99,36.58 30.99,38.35 X3.3
N$12
  Top 0.305: U6.6 30.35,35.69 C24.2 30.1,36.96 X3.1
N$15
  Top 0.152: D2.+ R3.1
N$16
  Top 0.305: U5.8 20.46,30.85 C19.2 25.15,29.08 X1.3
N$17
  Top 0.305: U5.9 20.82,31.5 21.46,30.86 C20.2 23.88,30.86 X1.1
N$20
  Top 0.254: U3.8 44.34,11.57 R10.1
QSPI_CSN  (via drill 0.25 pad 0.51)
  Top 0.152: U2.56 17.84,11.88 17.91,11.81 v18.16,11.81 | v27.56,25.4 25.53,23.37 U4.1 25.53,19.81 26.03,19.3 26.03,15.88 25.65,15.49 24.51,15.49 v24.38,15.37 | R9.1 27.3,34.67 28.07,33.91 28.07,30.1 v28.32,29.84
  Bottom 0.152: v24.38,15.37 22.35,13.34 20.32,13.34 19.18,12.19 18.54,12.19 v18.16,11.81 | v27.56,25.4 27.56,29.08 v28.32,29.84
QSPI_SCK  (via drill 0.25 pad 0.51)
  Top 0.152: U2.52 16.24,11.51 16.76,10.99 19.24,10.99 v19.3,11.05 | U4.6 v22.99,12.45
  Bottom 0.152: v19.3,11.05 20.57,12.32 22.86,12.32 v22.99,12.45
QSPI_SIO_0  (via drill 0.25 pad 0.51)
  Top 0.152: U2.53 16.64,11.55 16.89,11.3 18.54,11.3 v18.8,11.56 | U4.5 21.72,13.08 21.46,12.83 v21.15,12.83
  Bottom 0.152: v18.8,11.56 19.18,11.56 20.45,12.83 v21.15,12.83
QSPI_SIO_1  (via drill 0.25 pad 0.51)
  Top 0.152: U2.55 17.44,13.42 v17.4,13.46 | U4.2 24.26,16.26 v23.88,15.88
  Bottom 0.152: v17.4,13.46 19.43,13.46 20.07,14.1 21.72,14.1 22.73,15.11 22.73,15.49 23.11,15.88 v23.88,15.88
QSPI_SIO_2  (via drill 0.25 pad 0.51)
  Top 0.152: U4.3 22.99,15.75 v23.37,15.37 | v16.89,12.95 17.04,12.8 U2.54
  Bottom 0.152: v16.89,12.95 19.43,12.95 20.19,13.72 21.84,13.72 23.37,15.24 v23.37,15.37
QSPI_SIO_3  (via drill 0.25 pad 0.51)
  Top 0.152: U2.51 15.84,11.47 16.64,10.67 18.92,10.67 19.05,10.54 v20.07,10.54 | U4.7 v24.26,12.45
  Bottom 0.152: v20.07,10.54 20.07,11.18 20.83,11.94 23.75,11.94 v24.26,12.45
RST_N
  Top 0.152: U5.19 12.42,26.95 10.54,28.83 R11.1
RUN  (via drill 0.25 pad 0.51)
  Top 0.152: U2.26 13.44,19.45 12.83,20.07 12.83,24.51 14.16,25.84 14.16,26.99 v14.99,27.81 | K2.2 12.13,37.02 R14.1 11.43,35.81 v12.06,35.18
  Bottom 0.152: v12.06,35.18 14.99,32.26 v14.99,27.81
RX  (via drill 0.25 pad 0.51)
  Top 0.152: U2.3 19.81,13.69 20.19,14.08 20.19,14.6 21.08,15.49 21.08,17.65 v21.34,17.91
  Bottom 0.152: v21.34,17.91 20.76,18.48 19.37,18.48 19.18,18.29 18.54,18.29 17.02,19.81 17.02,25.78 16,26.8 8.25,26.8 7.49,27.56 7.49,28.83 5.84,30.48 J1.9
RX_CAN  (via drill 0.25 pad 0.51)
  Top 0.152: D2.- 35.94,3.87 35.94,4.45 | U5.2 21.31,26.95 21.59,26.67 23.37,26.67 23.75,26.29 28.32,26.29 29.21,25.4 v29.21,21.72 | 35.94,4.7 35.69,4.7 | v34.67,4.7 35.56,4.7 35.69,4.7 | 35.94,4.45 35.94,4.7 | 35.94,4.7 35.94,4.95 | 35.94,4.95 35.94,7.24 36.46,7.76 U3.4 | 35.69,4.7 35.94,4.95 | 35.69,4.7 35.94,4.45
  Bottom 0.152: v34.67,4.7 32.25,4.7 28.83,8.12 28.83,20.07 28.57,20.32 28.57,21.08 v29.21,21.72
RX_CANFD  (via drill 0.25 pad 0.51)
  Top 0.152: v35.43,34.8 U6.2 35.43,31.75 35.56,31.62 35.75,31.43 36.58,30.61 40.39,30.61 41.16,31.38 U8.4 | D7.- 35.75,39.56 v35.69,39.5
  Bottom 0.152: v35.43,34.8 36.07,35.43 36.07,39.12 v35.69,39.5
SCK  (via drill 0.25 pad 0.51)
  Top 0.152: U2.4 18.16,14.09 v17.78,14.48 | v1.52,12.32 1.52,12.57 0.89,13.21 0.89,31.11 2.54,32.77 7.37,32.77 8.13,32 10.54,32 12.36,30.18 U5.14 16.47,30.18 17.14,30.86 17.14,33.66 v17.78,34.29 | U6.10 31.62,29.08 30.61,30.1 30.48,30.23 v30.48,31.75
  Bottom 0.152: v17.78,14.48 16.64,14.48 16,13.84 16,11.94 18.41,9.52 20.45,9.52 24.38,5.59 J4.2 23.27,3.3 21.08,3.3 20.32,4.06 20.32,5.59 19.3,6.6 12.06,6.6 8,10.67 8,11.68 7.75,11.94 2.29,11.94 1.9,12.32 v1.52,12.32 | v17.78,34.29 26.42,34.29 28.96,31.75 v30.48,31.75
SCL  (via drill 0.25 pad 0.51)
  Top 0.152: U2.9 19.78,16.09 20.45,16.76 20.45,18.8 v20.19,19.05 | v14.22,24.51 15.24,24.51 16.13,25.4 21.34,25.4 21.59,25.15 22.35,25.15 v22.86,25.65
  Bottom 0.152: v14.22,24.51 13.97,24.51 13.84,24.64 7.87,24.64 6.45,23.21 J1.6 | v22.86,25.65 22.48,25.27 22.48,20.32 21.21,19.05 v20.19,19.05
SDA  (via drill 0.25 pad 0.51)
  Top 0.152: U2.8 19.88,15.69 20.76,16.57 20.76,19.62 v20.83,19.68 | v14.73,25.02 14.99,25.02 15.68,25.72 22.03,25.72 v22.1,25.65
  Bottom 0.152: v14.73,25.02 6.58,25.02 J1.7 | v22.1,25.65 22.1,20.95 v20.83,19.68
SWDCLK  (via drill 0.25 pad 0.51)
  Top 0.152: U2.24 14.24,18.4 14.48,18.16 15.37,18.16 v15.49,18.03
  Bottom 0.152: v15.49,18.03 16.26,18.03 18.03,16.26 19.94,16.26 20.45,16.76 22.35,16.76 22.73,17.14 26.92,17.14 28.32,15.75 28.32,8.06 32.19,4.19 33.27,4.19 35.05,2.41 J3.3
SWDIO  (via drill 0.25 pad 0.51)
  Top 0.152: U2.25 13.84,18.16 v14.35,17.65
  Bottom 0.152: v14.35,17.65 14.48,17.53 16.26,17.53 17.91,15.88 20.07,15.88 20.57,16.38 22.48,16.38 22.86,16.76 26.8,16.76 27.94,15.62 27.94,7.94 32.04,3.84 32.07,3.81 32.51,3.37 J3.2
TX  (via drill 0.25 pad 0.51)
  Top 0.152: U2.2 19.94,13.29 20.7,14.06 20.7,14.54 21.53,15.37 21.53,17.21 v21.59,17.27
  Bottom 0.152: J1.8 5.84,28.07 8.51,25.4 14.22,25.4 14.73,25.91 15.75,25.91 16.26,25.4 16.26,19.56 18.54,17.27 v21.59,17.27
TX_CAN  (via drill 0.25 pad 0.51)
  Top 0.152: 36.81,11.57 U3.1 37.7,11.57 37.97,11.3 37.97,7.49 36.45,5.97 v36.45,4.7 36.83,4.32 36.83,2.79 36,1.97 D1.- | U5.1 23.23,26.3 23.62,25.91 28.07,25.91 28.7,25.27 28.7,21.34 v29.21,20.83
  Bottom 0.152: v36.45,4.7 35.94,5.21 32.26,5.21 29.21,8.26 v29.21,20.83
TX_CANFD  (via drill 0.25 pad 0.51)
  Top 0.152: v36.7,34.67 U6.1 36.7,32.64 36.96,32.38 37.34,32.38 37.66,32.7 37.72,32.77 38.73,33.78 40.51,33.78 41.41,32.88 U8.1 | v36.96,38.35 D6.-
  Bottom 0.152: v36.7,34.67 36.7,38.1 v36.96,38.35
USB+
  Top 0.152: J10.3 13.17,6.45 13.02,6.6 13.02,6.86 13.97,7.81 13.97,10.8 14.16,10.99 14.22,11.05 14.24,11.06 U2.47
USB-
  Top 0.152: J10.2 12.52,6.42 12.71,6.62 12.71,6.98 13.59,7.86 13.59,10.92 13.84,11.18 U2.46
VCC_5V  (via drill 0.25 pad 0.51)
  Top 0.254: U8.3 40.77,31.88 40.51,31.62
  Top 0.406: D3.+ v5.71,5.46
  Top 0.508: C26.1 v40.13,31.37 40.39,31.62 40.51,31.62
  Bottom 0.508: v40.13,31.37 v40.13,18.03
  Bottom 1.676: J1.18 3.3,7.62 5.21,5.72
  other vias: 18.92,5.21 18.92,3.94 18.92,4.57
  pour Bottom (isolate 0.127, no thermals): 2.92,11.18 3.81,11.18 4.19,10.8 4.19,8 6.35,5.84 10.16,5.72 11.05,4.84 15.62,4.95 15.62,4.96 15.75,4.96 16.38,5.59 19.05,5.59 19.43,5.21 19.43,3.92 19.07,3.56 6.35,3.56 2.41,7.49 2.41,10.67
  pour Top (isolate 0.127, no thermals): 19.05,6.35 29.46,6.35 30.86,7.75 30.86,15.7 33.58,18.41 45.85,18.41 46.74,17.53 46.74,14.1 46.48,13.84 45.47,13.84 45.21,14.1 45.21,16 44.83,16.38 44.45,16.38 44.2,16.13 44.2,14.1 43.94,13.84 43.05,13.84 42.67,14.22 42.67,16.13 42.29,16.51 35.22,16.51 33.78,15.07 33.78,10.54 33.53,10.29 32.77,10.29 32.38,9.91 32.38,6.86 28.19,2.67 19.68,2.67 18.54,3.81 18.54,5.84
VIN
  pour Top (isolate 0.254, no thermals): 52.83,31.24 49.15,31.24 48.01,30.1 46.1,30.1 45.59,29.59 45.59,27.81 45.97,27.43 49.28,27.43 49.91,28.07 52.83,28.07 53.47,28.7 53.47,30.73 52.96,31.24
VIN_12V
  pour Top (isolate 0.254, no thermals): 34.16,26.29 39.12,26.29 42.16,29.34 42.8,29.34 43.18,28.96 43.18,27.3 40,24.13 33.4,24.13 32.89,24.64 32.89,25.78 33.4,26.29
XIN
  Top 0.203: U2.20 15.84,19.65 16.89,20.7 19.43,20.7 20.07,21.34 X2.1 20.07,21.72 20.51,22.16 20.57,22.23 20.83,22.48 C21.2
XOUT
  Top 0.203: U2.21 15.44,19.89 15.87,20.32 15.87,21.08 R15.1

### Text on the board
tPlace: CAN FD | RX | RST | TX | BOOT | LED | CAN FD 120Ω | 10 | RX | 19 | TX | 20 | SDA | A3 | SCL | 25 | 21 | 22 | A0 | 23 | A1 | 24 | A2 | GND | 5V | Iout=1A | IO8 | SCK | SO | CAN 20 120Ω | PWR | GND | SI | 3V | CAN 2.0 | RX | TX
bPlace: 9-28V | DUAL | GND | CANFDH | CANFDL | longan-labs.cc | CANH | CANL